# Altium schematic sheet Current_Source.SchDoc
size A; SheetNumber: 4; SheetTotal: 4
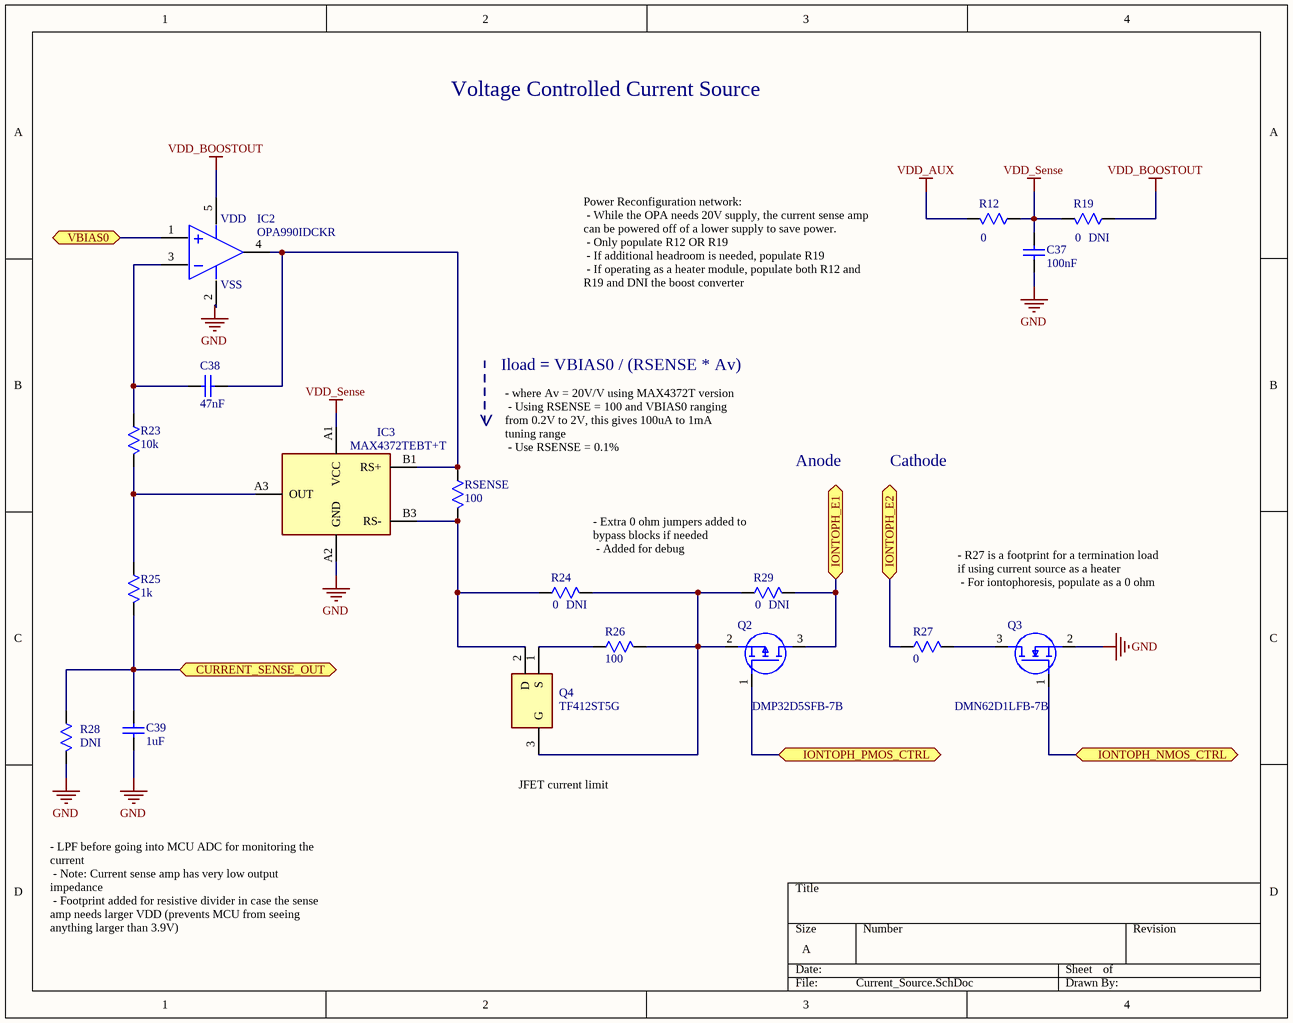
[diagram p0: Current_Source.SchDoc]

## Parts
C37  value 100nF  [0201 cap]  (hidden comment: CAP)
C38  value 47nF  [0201 cap]  (hidden comment: CAP)
C39  value 1uF  [0201 cap]  (hidden comment: CAP)
IC2  OPA990IDCKR  [SOT65P210X110-5N]
IC3  MAX4372TEBT+T  [BGA5C50P3X2_152X100X67]
Q2  DMP32D5SFB-7B  [DESD6V8DLP7]
Q3  DMN62D1LFB-7B  [DESD6V8DLP7]
Q4  TF412ST5G  [TF412ST5G]
R12  value 0  [0201 res]  (hidden comment: RES)
R19  value 0  Do Not Install: DNI  [0201 res]  (hidden comment: RES)
R23  value 10k  [0201 res]  (hidden comment: RES)
R24  value 0  Do Not Install: DNI  [0201 res]  (hidden comment: RES)
R25  value 1k  [0201 res]  (hidden comment: RES)
R26  value 100  [0402-RES]  (hidden comment: RES)
R27  value 0  [0201 res]  (hidden comment: RES)
R28  Do Not Install: DNI  [0201 res]  (hidden comment: RES)
R29  value 0  Do Not Install: DNI  [0201 res]  (hidden comment: RES)
RSENSE  value 100  [0402-RES]  (hidden comment: RES)

## Ports
CURRENT_SENSE_OUT (bidir), IONTOPH_E1 (bidir), IONTOPH_E2 (bidir), IONTOPH_NMOS_CTRL (bidir), IONTOPH_PMOS_CTRL (bidir), VBIAS0 (bidir)

## Nets
GND: C37.1 C39.1 IC2.2(V-) IC3.A2(GND) Q3.2(S) R28.2
VDD_AUX: R12.2
VDD_BOOSTOUT: IC2.5(V+) R19.1
VDD_Sense: C37.2 IC3.A1(VCC) R12.1 R19.2
CURRENT_SENSE_OUT: C39.2 R25.2 R28.1 ; port CURRENT_SENSE_OUT
IONTOPH_E1: Q2.3(D) R29.1 ; port IONTOPH_E1
IONTOPH_E2: R27.1 ; port IONTOPH_E2
IONTOPH_NMOS_CTRL: Q3.1(G) ; port IONTOPH_NMOS_CTRL
IONTOPH_PMOS_CTRL: Q2.1(G) ; port IONTOPH_PMOS_CTRL
VBIAS0: IC2.1(IN+) ; port VBIAS0
NetC38_1: C38.1 IC2.3(IN-) R23.1
NetC38_2: C38.2 IC2.4(OUT) IC3.B1(RS+) RSENSE.1
NetIC3_A3: IC3.A3(OUT) R23.2 R25.1
NetIC3_B3: IC3.B3(RS-) Q4.2(D) R24.2 RSENSE.2
NetQ2_2: Q2.2(S) Q4.3(G) R24.1 R26.2 R29.2
NetQ3_3: Q3.3(D) R27.2
NetQ4_1: Q4.1(S) R26.1

## Notes on the sheet
- Voltage Controlled Current Source
- Power Reconfiguration network:
  - While the OPA needs 20V supply, the current sense amp can be powered off of a lower supply to save power.
  - Only populate R12 OR R19
  - If additional headroom is needed, populate R19
  - If operating as a heater module, populate both R12 and R19 and DNI the boost converter
- Iload = VBIAS0 / (RSENSE * Av)
- >
- |
- (near RSENSE) - where Av = 20V/V using MAX4372T version
  - Using RSENSE = 100 and VBIAS0 ranging from 0.2V to 2V, this gives 100uA to 1mA tuning range
  - Use RSENSE = 0.1%
- Anode
- Cathode
- - Extra 0 ohm jumpers added to bypass blocks if needed
  - Added for debug
- - R27 is a footprint for a termination load if using current source as a heater
  - For iontophoresis, populate as a 0 ohm
- (near Q4) JFET current limit
- - LPF before going into MCU ADC for monitoring the current
  - Note: Current sense amp has very low output impedance
  - Footprint added for resistive divider in case the sense amp needs larger VDD (prevents MCU from seeing anything larger than 3.9V)
- (in symbol OPA990IDCKR) VDD; VSS

## Library data of the parts
C37-C39 = CAP SMD: Multilayer Chip Capacitor; Designer: OMIGA
IC2 = OPA990IDCKR: Integrated Circuit; Manufacturer_Name: Texas Instruments; Datasheet Link: https://www.ti.com/lit/gpn/OPA990; Height: 1.1mm; Manufacturer_Part_Number: OPA990IDCKR; Mouser Part Number: 595-OPA990IDCKR; Mouser Price/Stock: https://www.mouser.co.uk/ProductDetail/Texas-Instruments/OPA990IDCKR?qs=XeJtXLiO41TSF5QBGuARgQ%3D%3D; Arrow Part Number: OPA990IDCKR; Arrow Price/Stock: https://www.arrow.com/en/products/opa990idckr/texas-instruments?region=nac
IC3 = MAX4372TEBT+T: Integrated Circuit; Manufacturer_Name: Analog Devices; Datasheet Link: https://pdfserv.maximintegrated.com/en/ds/MAX4372-MAX4372T.pdf; Height: 0.67mm; Manufacturer_Part_Number: MAX4372TEBT+T; Mouser Part Number: 700-MAX4372TEBT+T; Mouser Price/Stock: https://www.mouser.co.uk/ProductDetail/Maxim-Integrated/MAX4372TEBT%2bT?qs=1eQvB6Dk1vi20izC9qMksw%3D%3D
Q2 = DMP32D5SFB-7B: MOSFET (P-Channel); Manufacturer_Name: Diodes Inc.; Datasheet Link: https://www.diodes.com/assets/Datasheets/DMP32D5SFB.pdf; Height: 0.53mm; Manufacturer_Part_Number: DMP32D5SFB-7B; Mouser Part Number: 621-DMP32D5SFB-7B; Mouser Price/Stock: https://www.mouser.co.uk/ProductDetail/Diodes-Incorporated/DMP32D5SFB-7B?qs=MNIFWdyJgboORiafCqUWHQ%3D%3D; Arrow Part Number: DMP32D5SFB-7B; Arrow Price/Stock: https://www.arrow.com/en/products/dmp32d5sfb-7b/diodes-incorporated
Q3 = DMN62D1LFB-7B: MOSFET (N-Channel); Manufacturer_Name: Diodes Inc.; Datasheet Link: https://www.diodes.com/assets/Datasheets/DMN62D1LFB.pdf; Height: 0.53mm; Manufacturer_Part_Number: DMN62D1LFB-7B; Mouser Part Number: 621-DMN62D1LFB-7B; Mouser Price/Stock: https://www.mouser.co.uk/ProductDetail/Diodes-Incorporated/DMN62D1LFB-7B?qs=y6ZabgHbY%252BxTi2UB8%252BIvCg%3D%3D; Arrow Part Number: DMN62D1LFB-7B; Arrow Price/Stock: https://www.arrow.com/en/products/dmn62d1lfb-7b/diodes-incorporated?region=nac
Q4 = TF412ST5G: N-ch JFET Transistor; Manufacturer_Name: onsemi; Datasheet Link: https://datasheet.datasheetarchive.com/originals/distributors/DKDS-17/338694.pdf; Height: 0.44mm; Manufacturer_Part_Number: TF412ST5G; Mouser Part Number: 863-TF412ST5G; Mouser Price/Stock: https://www.mouser.co.uk/ProductDetail/onsemi/TF412ST5G?qs=k6dkFvHqcvBP99I1DFAJcQ%3D%3D; Arrow Part Number: TF412ST5G; Arrow Price/Stock: https://www.arrow.com/en/products/tf412st5g/on-semiconductor
R12 R19 R23-R29 RSENSE = RES SMD: Surface Mount Resistor; Designer: OMIGA